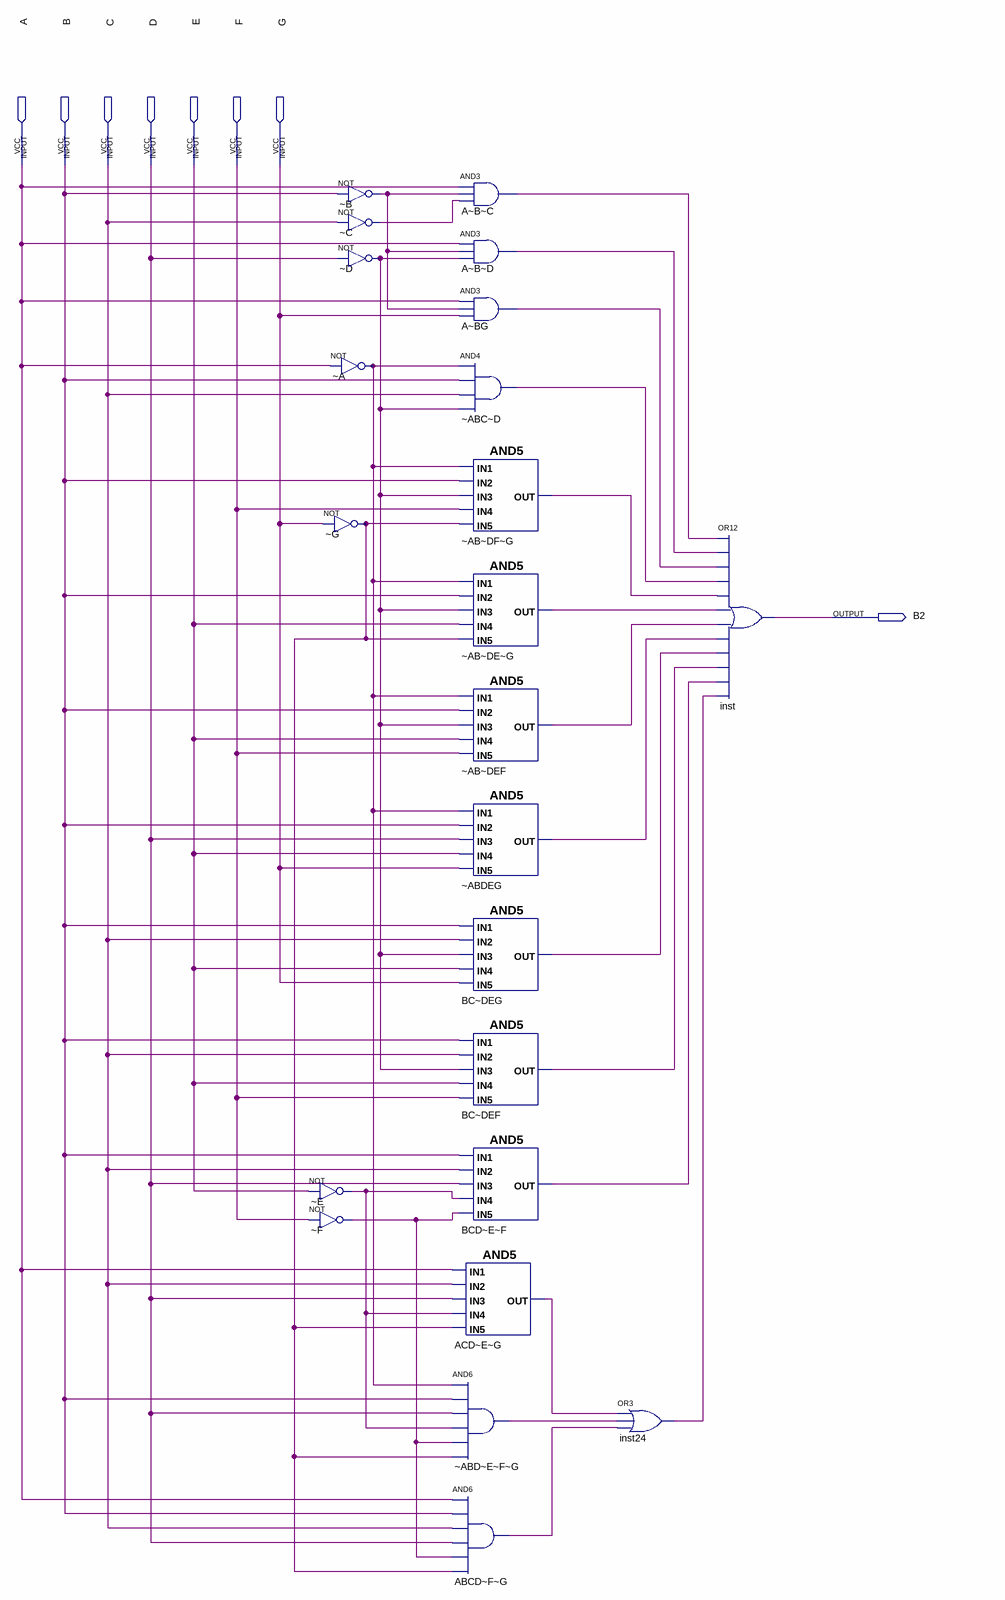
[diagram p0: schematic sheet]
// Quartus schematic posicao6.bdf as structural Verilog: 23 symbols, 8 pins
module posicao6 (
  input  A,
  input  B,
  input  C,
  input  D,
  input  E,
  input  F,
  input  G,
  output B2
);

  wire _A_out, _AB_DE_G_out, _AB_DEF_out, _AB_DF_G_out, _ABC_D_out, _ABD_E_F_G_out, _ABDEG_out, _B_out,
       _C_out, _D_out, _E_out, _F_out, _G_out, A_B_C_out, A_B_D_out, A_BG_out, ABCD_F_G_out, ACD_E_G_out,
       BC_DEF_out, BC_DEG_out, BCD_E_F_out, inst24_out;

  not \u_~B  (_B_out, B);
  not \u_~C  (_C_out, C);
  not \u_~D  (_D_out, D);
  not \u_~A  (_A_out, A);
  not \u_~G  (_G_out, G);
  not \u_~E  (_E_out, E);
  not \u_~F  (_F_out, F);
  and \A~B~C  (A_B_C_out, A, _B_out, _C_out);
  and \A~B~D  (A_B_D_out, A, _B_out, _D_out);
  and \A~BG  (A_BG_out, A, _B_out, G);
  and \u_~ABC~D  (_ABC_D_out, _A_out, B, C, _D_out);
  and \u_~AB~DF~G  (_AB_DF_G_out, _A_out, B, _D_out, F, _G_out);
  and \u_~AB~DE~G  (_AB_DE_G_out, _A_out, B, _D_out, E, _G_out);
  and \u_~AB~DEF  (_AB_DEF_out, _A_out, B, _D_out, E, F);
  and \u_~ABDEG  (_ABDEG_out, _A_out, B, D, E, G);
  and \BC~DEG  (BC_DEG_out, B, C, _D_out, E, G);
  and \BC~DEF  (BC_DEF_out, B, C, _D_out, E, F);
  and \BCD~E~F  (BCD_E_F_out, B, C, D, _E_out, _F_out);
  and \ACD~E~G  (ACD_E_G_out, A, C, D, _E_out, _G_out);
  and \u_~ABD~E~F~G  (_ABD_E_F_G_out, _A_out, B, D, _E_out, _F_out, _G_out);
  and \ABCD~F~G  (ABCD_F_G_out, A, B, C, D, _F_out, _G_out);
  or inst24 (inst24_out, ACD_E_G_out, _ABD_E_F_G_out, ABCD_F_G_out);
  or inst (B2, A_B_C_out, A_B_D_out, A_BG_out, _ABC_D_out, _AB_DF_G_out, _AB_DE_G_out, _AB_DEF_out, _ABDEG_out, BC_DEG_out, BC_DEF_out, BCD_E_F_out, inst24_out);
endmodule
